# EAGLE design OKADIRI_1stGroup (EAGLE 9.2.2)
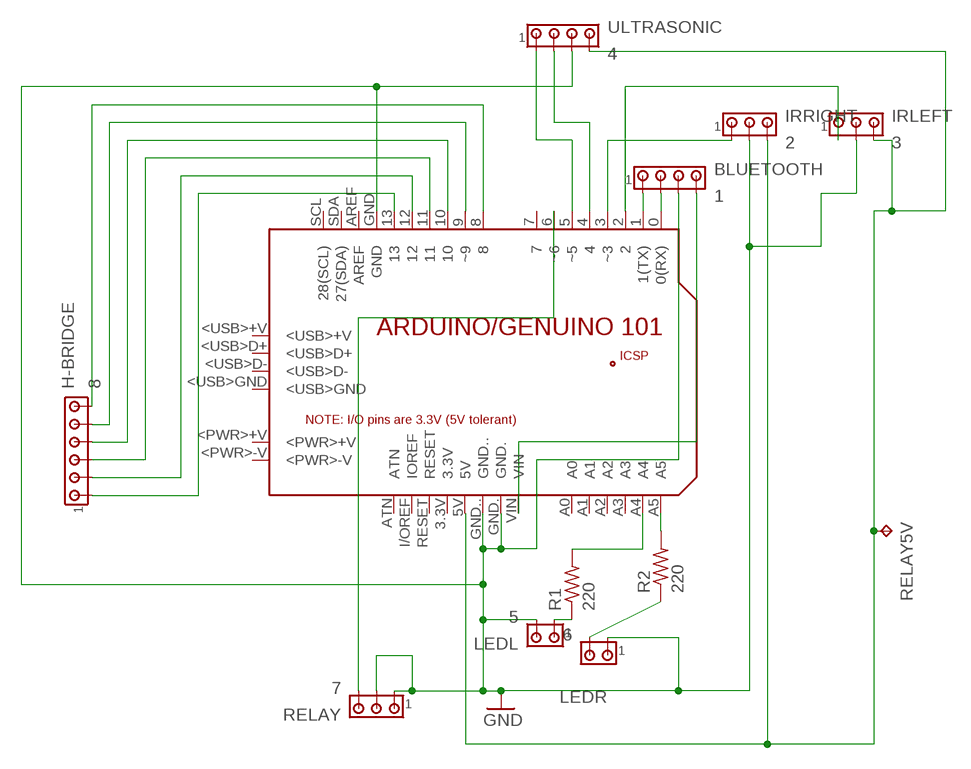
[diagram p0: schematic, sheet 1]

## Parts
BLUETOOTH  1  MTA04-100  [10X04MTA]
H-BRIDGE  8  MTA06-100  [10X06MTA]
IRLEFT  3  MTA03-100  [10X03MTA]
IRRIGHT  2  MTA03-100  [10X03MTA]
LEDL  5  MTA02-100  [10X02MTA]
LEDR  6  MTA02-100  [10X02MTA]
PCB1  ARDUINO_101  [ARDUINO_101]
R1  220  R-US_0309/10  [0309/10]
R2  220  R-US_0309/10  [0309/10]
RELAY  7  MTA03-100  [10X03MTA]
RELAY5V  TPPAD1-13Y  [P1-13Y]
ULTRASONIC  4  MTA04-100  [10X04MTA]

## Nets
GND: BLUETOOTH.3 IRLEFT.2 IRRIGHT.2 LEDL.2 LEDR.1 PCB1.GND PCB1.GND. PCB1.GND.. RELAY.1 RELAY.2 ULTRASONIC.3
N$1: BLUETOOTH.1 PCB1.1(1(TX))
N$2: IRLEFT.1 PCB1.2
N$3: BLUETOOTH.2 PCB1.0(0(RX))
N$4: BLUETOOTH.4 PCB1.VIN
N$5: LEDL.1 R1.1
N$6: PCB1.A4 R1.2
N$7: IRRIGHT.1 PCB1.3(~3)
N$8: PCB1.A5 R2.2
N$9: PCB1.4 ULTRASONIC.2
N$10: LEDR.2 R2.1
N$11: PCB1.5(~5) ULTRASONIC.1
N$13: PCB1.6(~6) RELAY.3
N$14: H-BRIDGE.6 PCB1.8
N$15: H-BRIDGE.5 PCB1.9(~9)
N$16: H-BRIDGE.4 PCB1.10
N$17: H-BRIDGE.3 PCB1.11
N$18: H-BRIDGE.2 PCB1.12
N$19: H-BRIDGE.1 PCB1.13
N$20: IRLEFT.3 IRRIGHT.3 PCB1.5V RELAY5V.TP ULTRASONIC.4
Unconnected: PCB1.3.3V PCB1.7 PCB1.+5V PCB1.<PWR>+V PCB1.<PWR>-V PCB1.<USB>+V PCB1.<USB>D+ PCB1.<USB>D- PCB1.<USB>GND PCB1.A0 PCB1.A1 PCB1.A2 PCB1.A3 PCB1.AREF PCB1.ATN PCB1.GND_ PCB1.I/OREF(IOREF) PCB1.MISO PCB1.MOSI PCB1.RESET PCB1.RESET. PCB1.SCK PCB1.SCL(28(SCL)) PCB1.SDA(27(SDA))

## Library data of the parts
BLUETOOTH ULTRASONIC = con-amp:MTA04-100: AMP connector
H-BRIDGE = con-amp:MTA06-100: AMP connector Connection corrected 2014-09-19
IRLEFT IRRIGHT RELAY = con-amp:MTA03-100: AMP connector
LEDL LEDR = con-amp:MTA02-100: AMP connector
PCB1 = Arduino_+Small+Shield:ARDUINO_101: Schematic symbol for representing an Arduino/Genuino 101 board in an EAGLE schematic. Created by Dave Young for Element14. More 101 documentation at: https://www.element14.com/community/docs/DOC-80459/l/intel-genuino-101-development-board More EAGLE documentation at: http://www.element14.com/community/community/knode/cadsoft_eagle
R1 R2 = ECE2240+Project:R-US_: RESISTOR, American symbol
RELAY5V = testpad:TP: Test pad

## Board
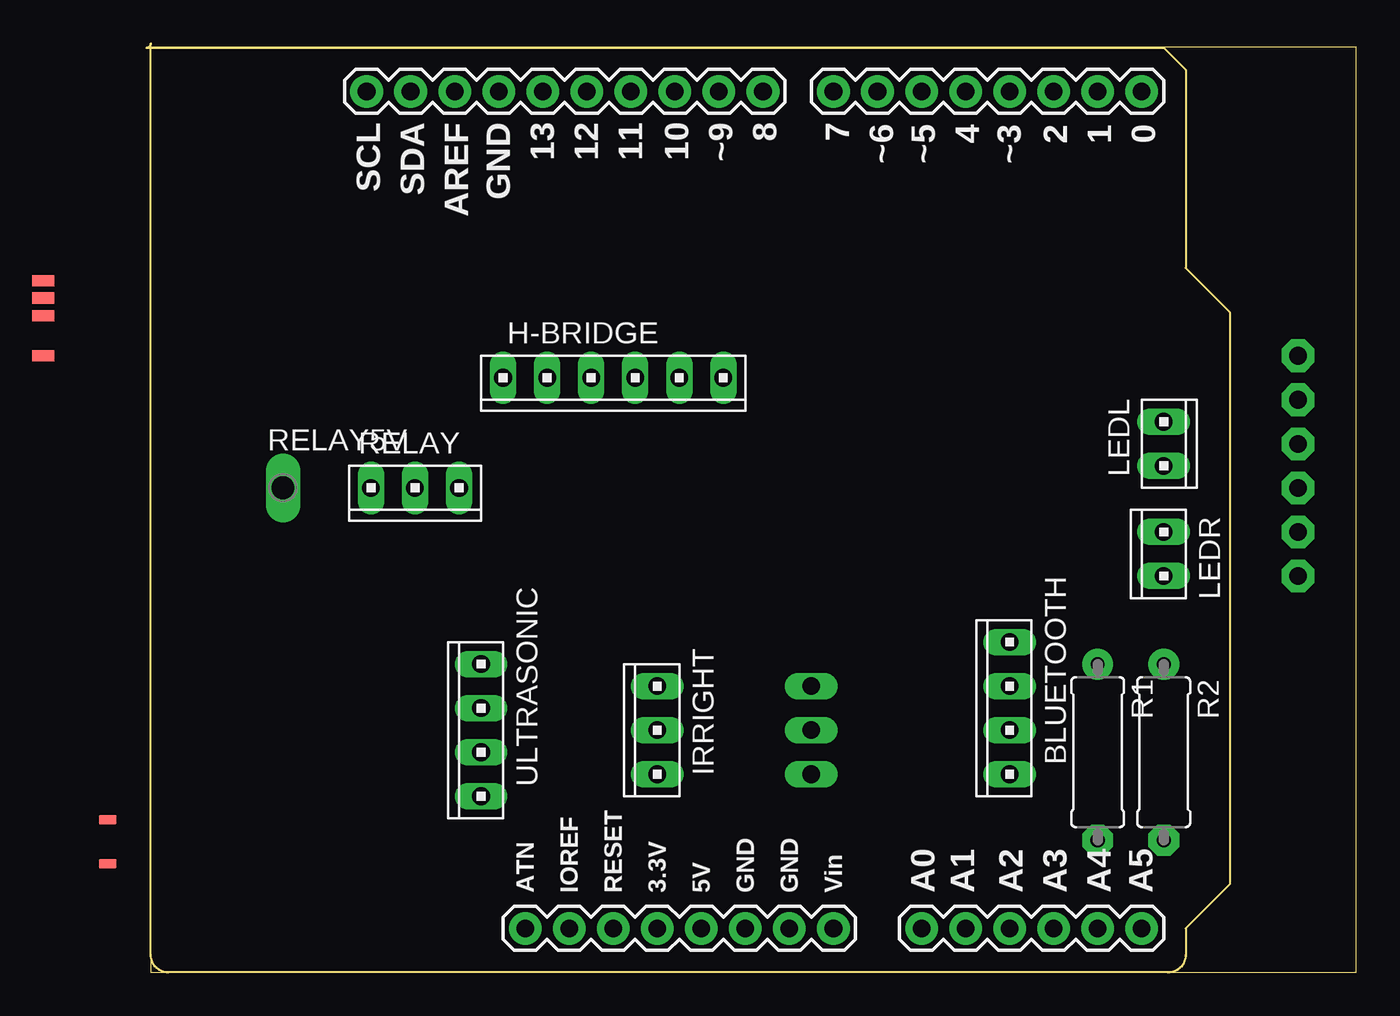
[diagram p1: board, top side]
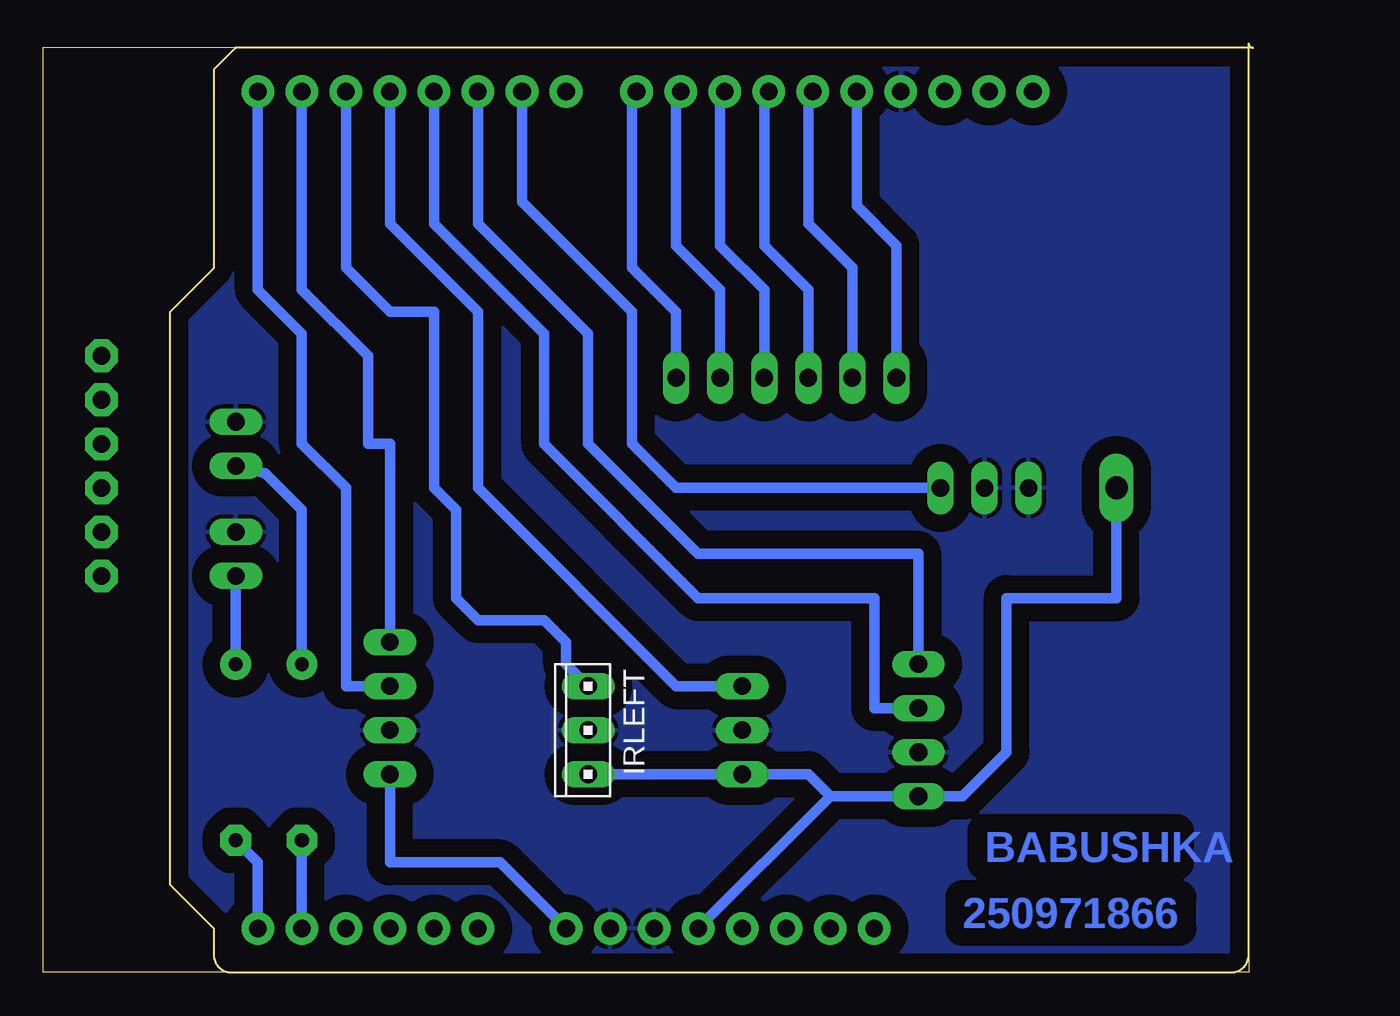
[diagram p2: board, bottom side, seen from below]

Size 69.52 x 53.33 mm. Coordinates in mm from the lower left corner, seen from the top.
Outline: 0,0 69.52,0 69.52,53.33 0,53.33 0,0
Copper layers (1*16): Top 0.035mm / dielectric 1.5mm / Bottom 0.035mm
Design rules "default *": minimum track width 6mil, minimum drill 0.35mm, track to track 12mil, track to pad 12mil, pad to pad 8mil, via to via 8mil, smd to smd 8mil, copper to edge 40mil, drill to drill 6mil, minimum pad ring 10mil, minimum via ring 8mil, stop-mask expansion 4mil, vias tented up to drill 0mil, thermal gap 10mil

### Footprints (pad centres in the part's own frame; a part is rotated, then mirrored left to right if it is on the bottom)
10X04MTA = drill 1.016 long: 1 3.81,0; 2 1.27,0; 3 -1.27,0; 4 -3.81,0
10X06MTA = drill 1.016 long: 1 6.35,0; 2 3.81,0; 3 1.27,0; 4 -1.27,0; 5 -3.81,0; 6 -6.35,0
10X03MTA = drill 1.016 long: 1 2.54,0; 2 0,0; 3 -2.54,0
10X02MTA = drill 1.016 long: 1 1.27,0; 2 -1.27,0
ARDUINO_101 = drill 1.016 pad 1.88: 0 27.94,25.4; 1 25.4,25.4; 2 22.86,25.4; 3 20.32,25.4; 3.3V 0,-22.86; 4 17.78,25.4; 5 15.24,25.4; 5V 2.54,-22.86; 6 12.7,25.4; 7 10.16,25.4; 8 6.096,25.4; 9 3.556,25.4; 10 1.016,25.4; 11 -1.524,25.4; 12 -4.064,25.4; 13 -6.604,25.4; A0 15.24,-22.86; A1 17.78,-22.86; A2 20.32,-22.86; A3 22.86,-22.86; A4 25.4,-22.86; A5 27.94,-22.86; AREF -11.684,25.4; ATN -7.62,-22.86; GND -9.144,25.4; GND. 7.62,-22.86; GND.. 5.08,-22.86; I/OREF -5.08,-22.86; RESET -2.54,-22.86; SCL -16.764,25.4; SDA -14.224,25.4; VIN 10.16,-22.86 | drill 1.016 pad 1.88 octagon: +5V 36.957,7.62; GND_ 36.957,10.16; MISO 36.957,5.08; MOSI 36.957,0; RESET. 36.957,-2.54; SCK 36.957,2.54 | smd 1.016 x 0.508: <PWR>+V -31.699,-16.586; <PWR>-V -31.699,-19.126 | smd 1.27 x 0.635: <USB>+V -35.408,14.478; <USB>D+ -35.408,13.487; <USB>D- -35.408,12.471; <USB>GND -35.408,10.16
0309/10 = drill 0.8 pad 1.778: 1 -5.08,0 | drill 0.813 pad 1.778 octagon: 2 5.08,0
P1-13Y = drill 1.321 pad 1.905 long: TP 0,0

### Placement (x,y rotation side)
BLUETOOTH  49.53,15.24 90 top
H-BRIDGE  26.67,34.29 180 top
IRLEFT  38.1,13.97 90 bottom
IRRIGHT  29.21,13.97 90 top
LEDL  58.42,30.48 270 top
LEDR  58.42,24.13 90 top
PCB1  29.21,25.4 0 top
R1  54.61,12.7 270 top
R2  58.42,12.7 270 top
RELAY  15.24,27.94 180 top
RELAY5V  7.62,27.94 0 top
ULTRASONIC  19.05,13.97 90 top

### Tracks (layer width: path | path; a pad name or v marks a point on that pad's centre or on a via)
GND
  pour Bottom (isolate 1.016): 0,1.27 0,52.07 0,53.34 58.42,53.34 59.69,52.07 59.69,40.64 62.23,38.1 62.23,5.08 59.69,2.54 59.69,0 58.42,0 0,0
N$1
  Bottom 0.61: PCB1.1 54.61,39.37 50.8,35.56 50.8,30.48 49.53,30.48 BLUETOOTH.1
N$2
  Bottom 0.61: PCB1.2 52.07,40.64 49.53,38.1 46.99,38.1 46.99,27.94 45.72,26.67 45.72,21.59 44.45,20.32 40.64,20.32 39.37,19.05 39.37,17.78 IRLEFT.1
N$3
  Bottom 0.61: PCB1.0 57.15,39.37 54.61,36.83 54.61,30.48 52.07,27.94 52.07,16.51 BLUETOOTH.2
N$4
  Bottom 0.61: BLUETOOTH.4 49.53,6.35 43.18,6.35 PCB1.VIN
N$5
  Bottom 0.61: LEDL.1 56.73,28.79 54.61,26.67 R1.1
N$6
  Bottom 0.61: PCB1.A4 R1.2
N$7
  Bottom 0.61: PCB1.3 49.53,43.18 44.45,38.1 44.45,27.94 33.02,16.51 IRRIGHT.1
N$8
  Bottom 0.61: PCB1.A5 57.15,6.35 R2.2
N$9
  Bottom 0.61: PCB1.4 46.99,43.18 40.64,36.83 40.64,30.48 31.75,21.59 21.59,21.59 21.59,15.24 ULTRASONIC.2
N$10
  Bottom 0.61: R2.1 LEDR.2
N$11
  Bottom 0.61: PCB1.5 44.45,43.18 38.1,36.83 38.1,30.48 31.75,24.13 19.05,24.13 ULTRASONIC.1
N$13
  Bottom 0.61: RELAY.3 33.02,27.94 35.56,30.48 35.56,35.56 35.56,38.1 41.91,44.45 PCB1.6
N$14
  Bottom 0.61: H-BRIDGE.6 33.02,38.1 35.56,40.64 35.56,50.55 PCB1.8
N$15
  Bottom 0.61: PCB1.9 33.02,50.55 33.02,41.91 30.48,39.37 H-BRIDGE.5
N$16
  Bottom 0.61: H-BRIDGE.4 27.94,39.37 30.48,41.91 30.48,50.55 PCB1.10
N$17
  Bottom 0.61: H-BRIDGE.3 25.4,39.37 27.94,41.91 27.94,50.55 PCB1.11
N$18
  Bottom 0.61: PCB1.12 25.4,50.55 25.4,43.18 22.86,40.64 H-BRIDGE.2
N$19
  Bottom 0.61: H-BRIDGE.1 20.32,41.91 22.61,44.2 PCB1.13
N$20
  Bottom 0.61: 24.13,10.16 ULTRASONIC.4 16.51,10.16 13.97,12.7 13.97,21.59 7.62,21.59 RELAY5V.TP | 24.13,10.16 PCB1.5V | IRLEFT.3 IRRIGHT.3 25.4,11.43 24.13,10.16

### Text on the board
Bottom: BABUSHKA | 250971866